# Altium project Splitter_aile_V1.PrjPcb
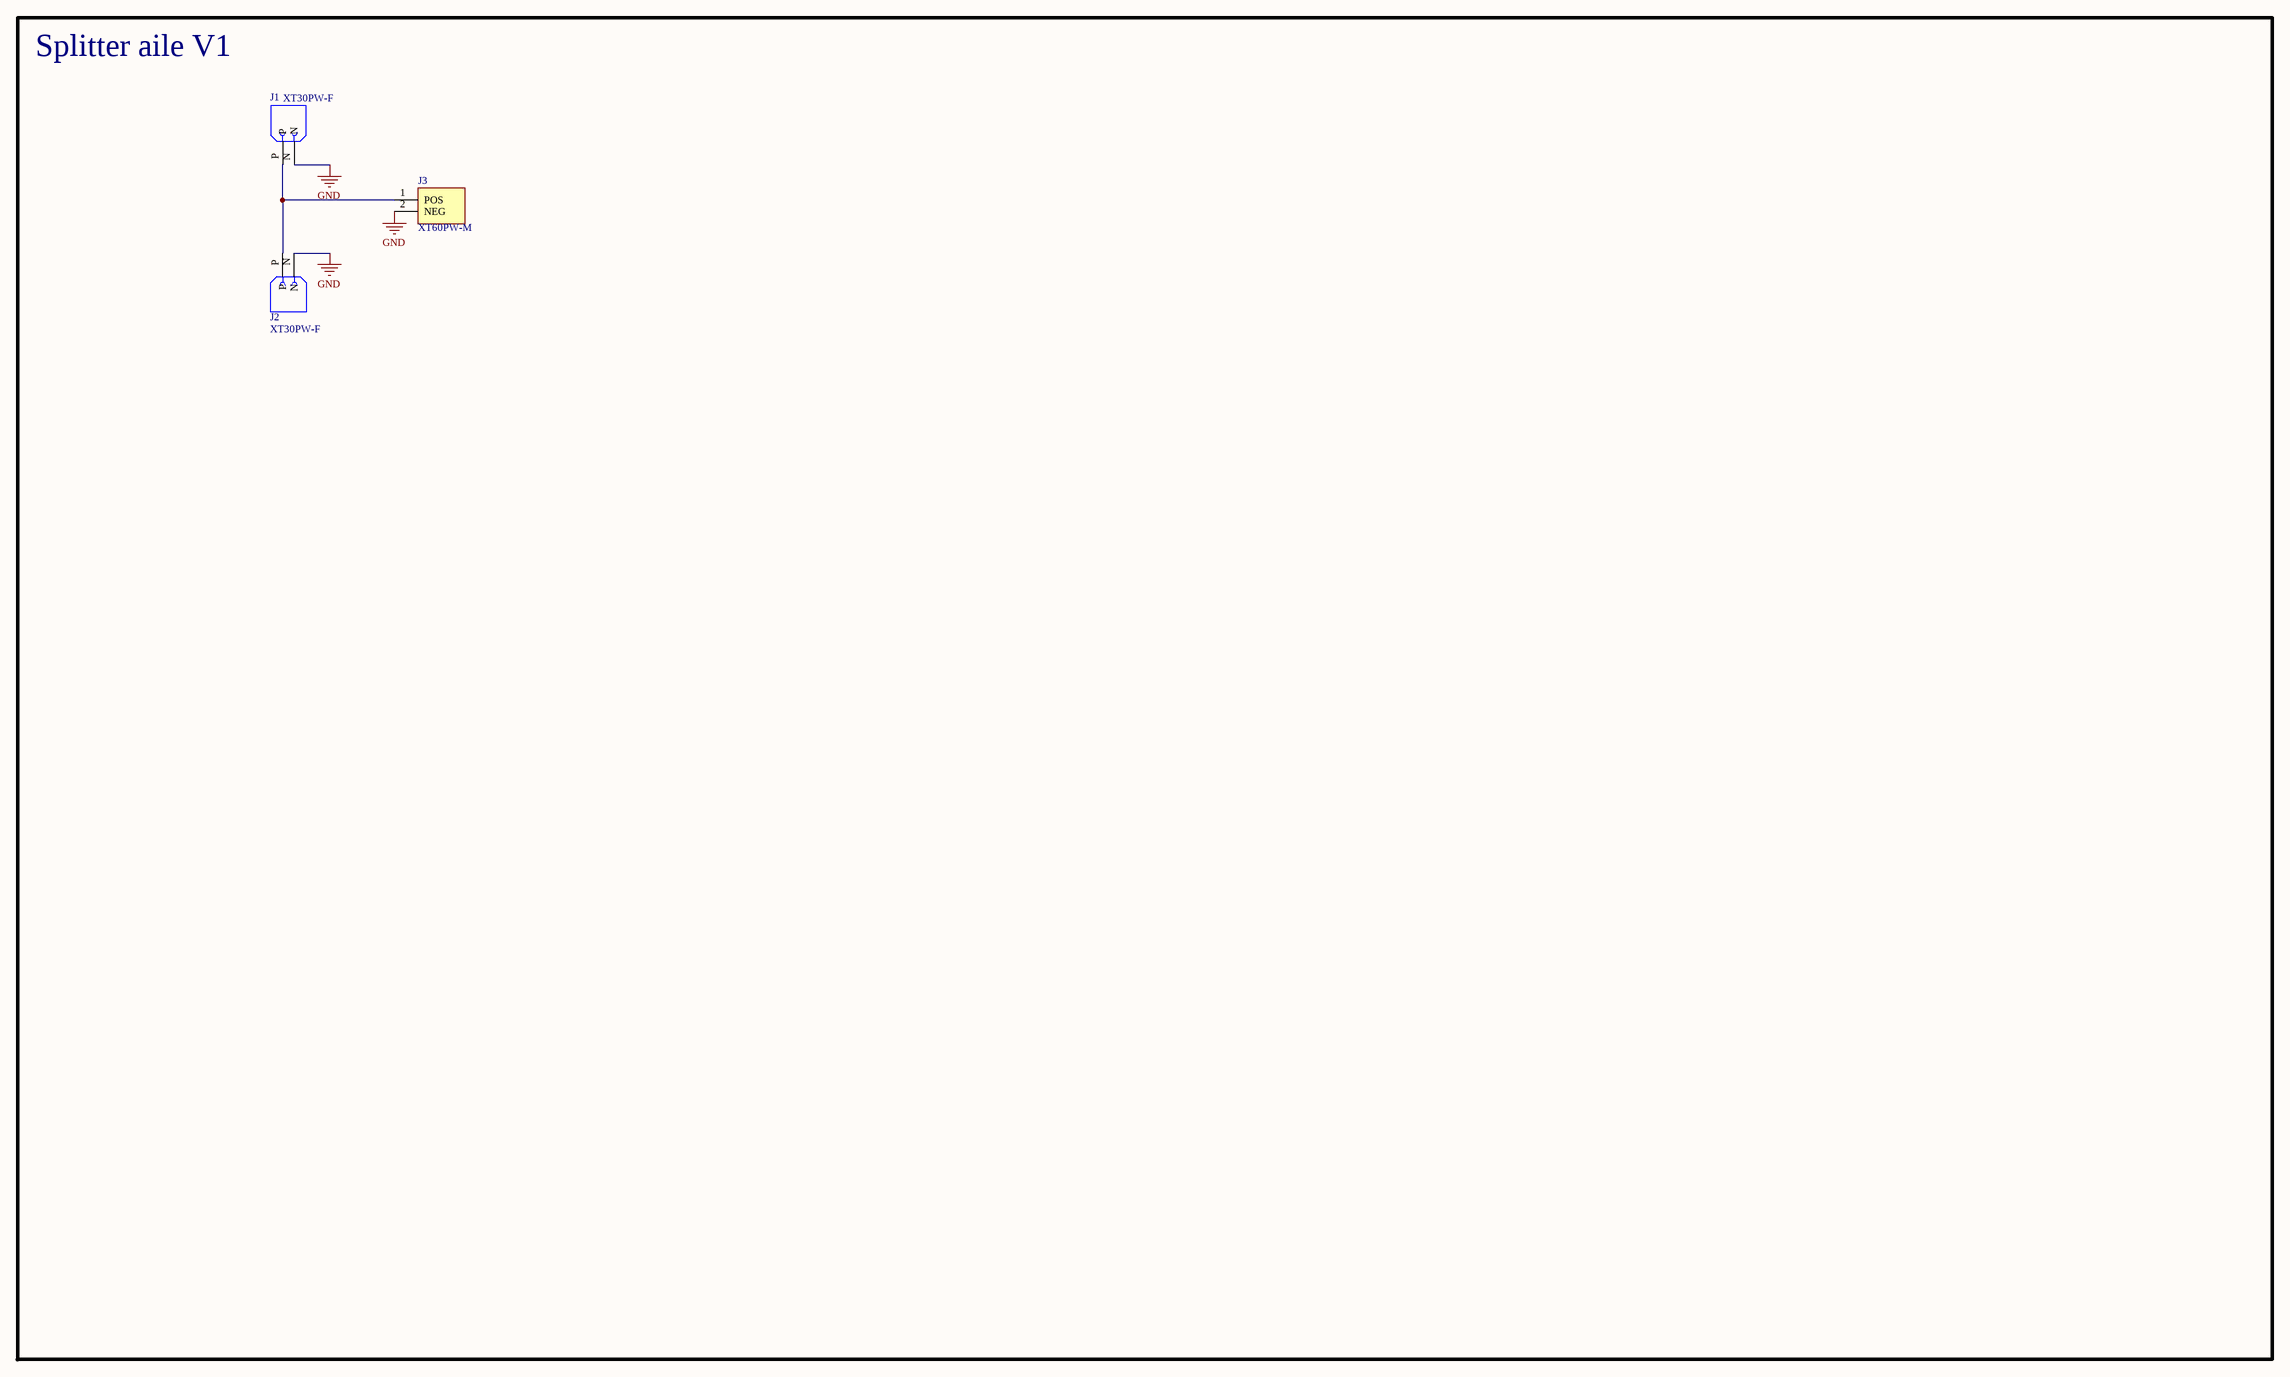
[diagram p0: Splitter_aile_V1_schem.SchDoc]
1 sheet, 3 parts. Net scope: global (net labels, ports and power ports of the same name join across sheets).
Board file: Splitter_aile_V1_PCB.PcbDoc

## Sheet Splitter_aile_V1_schem.SchDoc
size A2; SheetNumber: 1; SheetTotal: 1; SPICEModelCacheNIXBEUAC: <root> / <DocumentId>NIXBEUAC</DocumentId> / </root>

### Parts
J1  XT30PW-F  [AMASS_XT30PW-F]
J2  XT30PW-F  [AMASS_XT30PW-F]
J3  XT60PW-M  [AMASS_XT60PW-M]

### Blocks framed on the sheet
Splitter aile V1: J1-J3

### Nets
GND: J1.N J2.N J3.2(NEG)
NetJ1_P: J1.P J2.P J3.1(POS)

### Library data of the parts
J1 J2 = XT30PW-F: Socket; DC supply; XT30; female; PIN: 2; on PCBs; THT; yellow; 15A; MF: amass; SnapEDA_Link: https://www.snapeda.com/parts/XT30PW-F/AMASS/view-part/?ref=snap; Package: None; Value: *; MP: XT30PW-F; Check_prices: https://www.snapeda.com/parts/XT30PW-F/AMASS/view-part/?ref=eda
J3 = XT60PW-M: Socket, DC supply, male, PIN: 2; MF: AMASS; Check_prices: https://www.snapeda.com/parts/XT60PW-M/AMASS/view-part/?ref=eda; SnapEDA_Link: https://www.snapeda.com/parts/XT60PW-M/AMASS/view-part/?ref=snap; Price: None; Availability: Not in stock; Package: Package; MP: XT60PW-M; Value: *